# Altium schematic sheet Thermostat.schdoc: Thermostat
size 420 x 297 mm; EDA_Number: ARTIQ; Projet: Thermostat; CheckedBy: -; Author: G.Kasprowicz; CompanyName: WUT ISE; DrawnBy: G.Kasprowicz; Organization: WUT ISE; Address1: PW ISE; Address2: Nowowiejska 15/19 00-665 Warsaw; Address3: gkasprow@gmail.com; DocumentNumber: 1; SheetNumber: 1; SheetTotal: 6; ModifiedBy: -; CreateDate: -; CheckedDate: -; Title2: Top; DivGrp: WUT ISE; Designer: G.Kasprowicz; ModifiedDate: -; ProjectName: Sensor Box
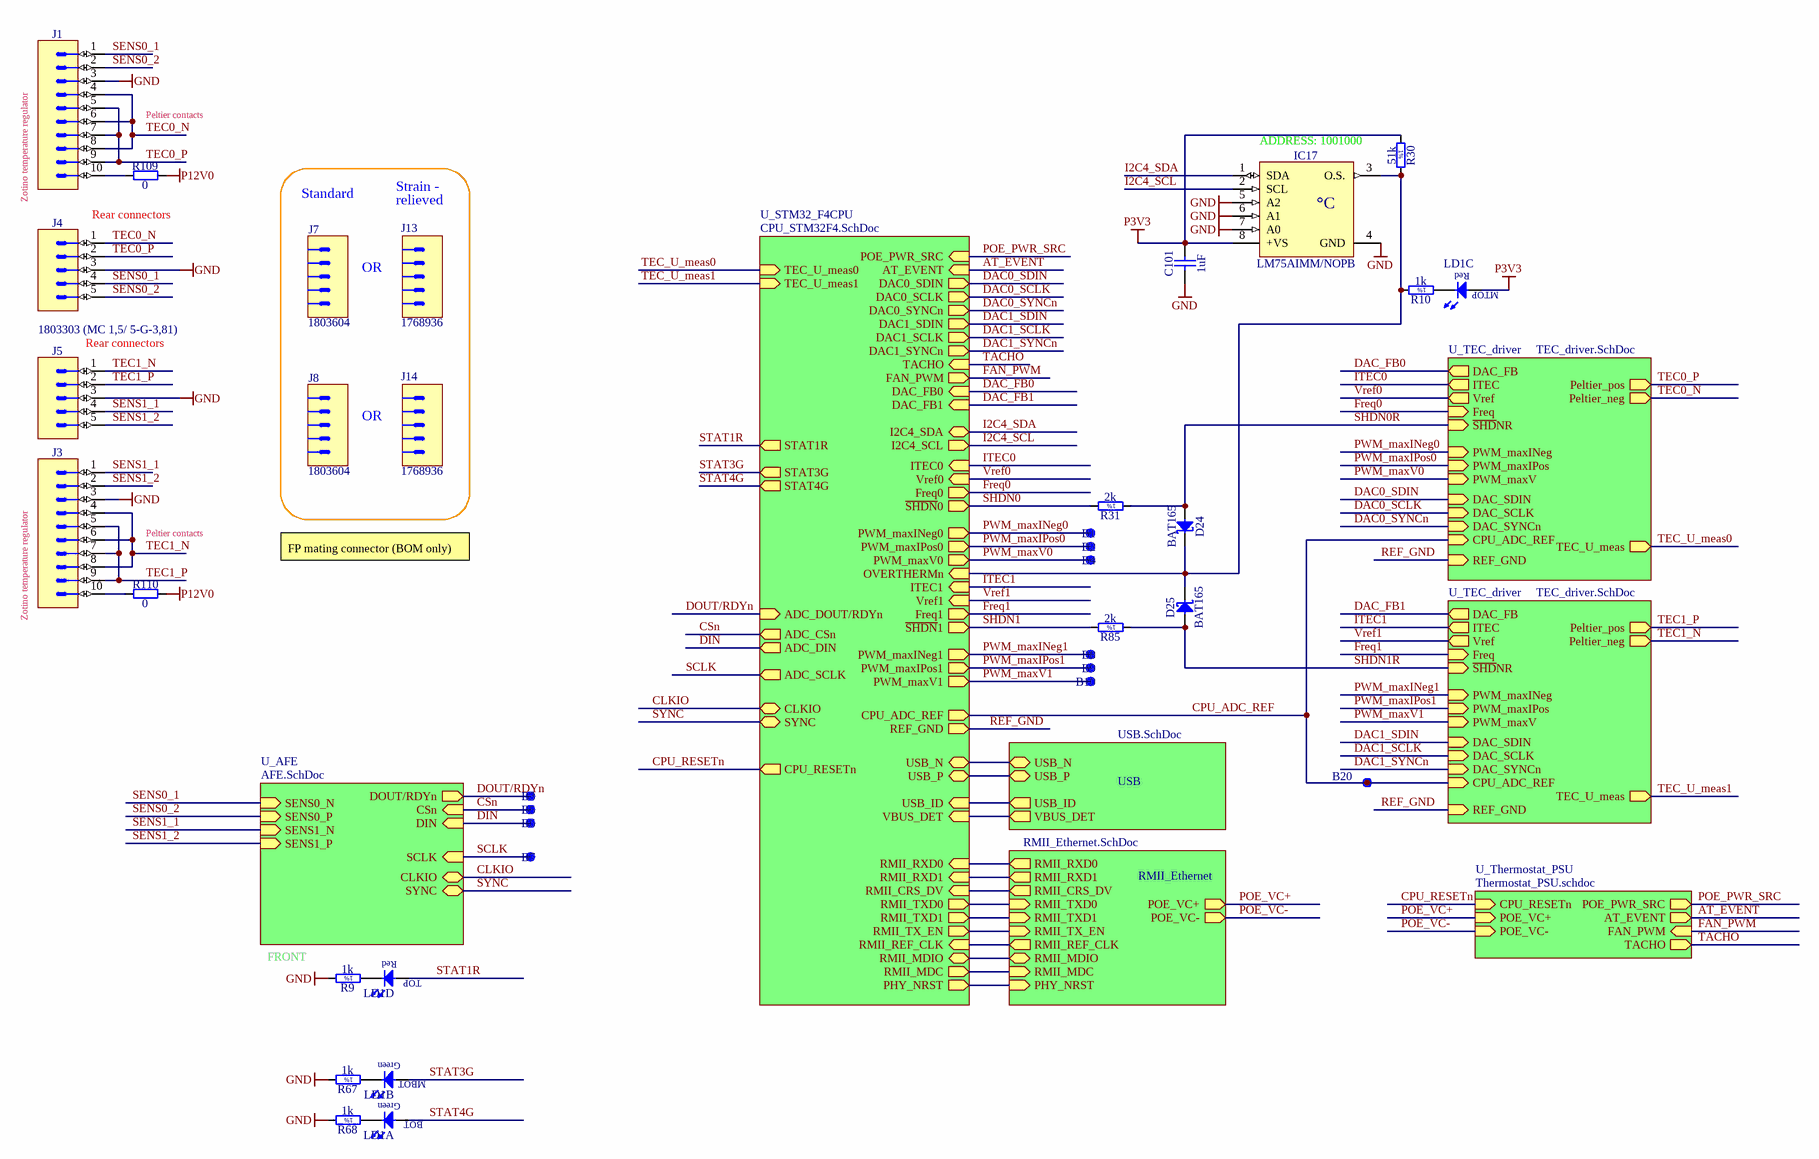
[diagram p0: Thermostat.schdoc]

## Parts
B1  SMD Pad  [C100]  (value not drawn)  (no BOM)
B2  SMD Pad  [C100]  (value not drawn)  (no BOM)
B3  SMD Pad  [C100]  (value not drawn)  (no BOM)
B4  SMD Pad  [C100]  (value not drawn)  (no BOM)
B5  SMD Pad  [C100]  (value not drawn)  (no BOM)
B6  SMD Pad  [C100]  (value not drawn)  (no BOM)
B7  SMD Pad  [C100]  (value not drawn)  (no BOM)
B8  SMD Pad  [C100]  (value not drawn)  (no BOM)
B9  SMD Pad  [C100]  (value not drawn)  (no BOM)
B10  SMD Pad  [C100]  (value not drawn)  (no BOM)
B20  SMD Pad  [C100]  (value not drawn)  (no BOM)
C101  1uF  [CAPC1608X87N]
D24  BAT165  [SOD2512X110N]
D25  BAT165  [SOD2512X110N]
IC17  LM75AIMM/NOPB  [SOP65P490X109-8N]
J1  Header 10  [3M_N2510-6002RB]  (value not drawn)
J3  Header 10  [3M_N2510-6002RB]  (value not drawn)
J4  PHOENIX_1803303  [PHOENIX_1803303]  (value not drawn)
J5  Manufacturer Part Number: 1803303 (MC 1,5/ 5-G-3,81)  [PHOENIX_1803303]  (hidden comment: PHOENIX_1803303)
J7  1803604  [PHOENIX_1803604]
J8  1803604  [PHOENIX_1803604]
J13  1768936  [PHOENIX_1768936]
J14  1768936  [PHOENIX_1768936]
LD1  Green/Green/HeRed/HeRed  [LED_BIVAR_H485CHHGGDL]  (value not drawn)  (parts A,B,C,D of 4)
R9  1k  [RESC1005X40N]
R10  1k  [RESC1005X40N]
R30  51k  [RESC1005X40N]
R31  2k  [RESC1005X40N]
R67  1k  [RESC1005X40N]
R68  1k  [RESC1005X40N]
R85  2k  [RESC1005X40N]
R109  0  [RESC1608X55N]
R110  0  [RESC1608X55N]

## Sub-sheets
RMII_Ethernet = RMII_Ethernet.SchDoc: RMII_TXD0 (in), RMII_TX_EN (in), RMII_RXD0 (out), RMII_REF_CLK (out), RMII_CRS_DV (out), RMII_MDC (in), RMII_MDIO (bidir), PHY_NRST (in), RMII_TXD1 (in), RMII_RXD1 (out), POE_VC+ (out), POE_VC- (out)
U_AFE = AFE.SchDoc: SCLK (in), DOUT/RDYn (out), SENS1_P (in), SENS1_N (in), SENS0_N (in), SENS0_P (in), CSn (in), DIN (in), CLKIO (bidir), SYNC (bidir)
U_STM32_F4CPU = CPU_STM32F4.SchDoc: STAT1R (out), OVERTHERMn (in), ITEC0 (in), Vref0 (in), Freq0 (out), ~{SHDN}0 (out), PWM_maxINeg0 (out), PWM_maxIPos0 (out), PWM_maxV0 (out), ITEC1 (in), Freq1 (out), ~{SHDN}1 (out), PWM_maxINeg1 (out), PWM_maxIPos1 (out), PWM_maxV1 (out), Vref1 (in), ADC_SCLK (out), ADC_DOUT/RDYn (in), ADC_CSn (out), ADC_DIN (out), USB_ID (in), RMII_RXD0 (in), USB_N (bidir), USB_P (bidir), RMII_TXD0 (out), RMII_RXD1 (in), RMII_MDC (out), RMII_TXD1 (out), RMII_TX_EN (out), RMII_CRS_DV (in), RMII_REF_CLK (in), RMII_MDIO (bidir), DAC0_SDIN (out), DAC0_SCLK (out), DAC0_SYNCn (out), DAC1_SDIN (out), DAC1_SCLK (out), DAC1_SYNCn (out), DAC_FB0 (in), DAC_FB1 (in), AT_EVENT (in), STAT3G (out), STAT4G (out), CLKIO (bidir), SYNC (bidir), TEC_U_meas0 (in), TEC_U_meas1 (in), CPU_RESETn (out), PHY_NRST (out), I2C4_SDA (bidir), I2C4_SCL (out), TACHO (in), CPU_ADC_REF (out), POE_PWR_SRC (in), REF_GND (out), FAN_PWM (out), VBUS_DET (in)
U_TEC_driver = TEC_driver.SchDoc: Peltier_pos (out), Peltier_neg (out), Freq (in), ~{SHD}NR (in), ITEC (out), Vref (out), PWM_maxINeg (in), PWM_maxIPos (in), PWM_maxV (in), DAC_SDIN (in), DAC_SYNCn (in), DAC_SCLK (in), DAC_FB (out), TEC_U_meas (out), REF_GND (in), CPU_ADC_REF (in)
U_TEC_driver = TEC_driver.SchDoc: Peltier_pos (out), Peltier_neg (out), Freq (in), ~{SHD}NR (in), ITEC (out), Vref (out), PWM_maxINeg (in), PWM_maxIPos (in), PWM_maxV (in), DAC_SDIN (in), DAC_SYNCn (in), DAC_SCLK (in), DAC_FB (out), TEC_U_meas (out), REF_GND (in), CPU_ADC_REF (in)
U_Thermostat_PSU = Thermostat_PSU.schdoc: CPU_RESETn (in), POE_VC+ (in), POE_VC- (in), POE_PWR_SRC (out), AT_EVENT (out), TACHO (out), FAN_PWM (in)
USB = USB.SchDoc: VBUS_DET (out), USB_N (bidir), USB_P (bidir), USB_ID (out)

## Nets
GND: C101.1 IC17.4(GND) IC17.5(A2) IC17.6(A1) IC17.7(A0) J1.3 J3.3 J4.3 J5.3 R9.2 R67.2 R68.2
P3V3: C101.2 IC17.8(+VS) LD1.6(A) R30.1
P12V0: R109.2 R110.2
~{SHDN}0: R31.2 ; sheet U_STM32_F4CPU/~{SHDN}0
~{SHDN}0R: D24.2(A) R31.1 ; sheet U_TEC_driver/~{SHD}NR
~{SHDN}1: R85.2 ; sheet U_STM32_F4CPU/~{SHDN}1
~{SHDN}1R: D25.2(A) R85.1 ; sheet U_TEC_driver/~{SHD}NR
AT_EVENT: sheet U_STM32_F4CPU/AT_EVENT, sheet U_Thermostat_PSU/AT_EVENT
CLKIO: sheet U_STM32_F4CPU/CLKIO, sheet U_AFE/CLKIO
CPU_ADC_REF: B20.1 ; sheet U_STM32_F4CPU/CPU_ADC_REF, sheet U_TEC_driver/CPU_ADC_REF, sheet U_TEC_driver/CPU_ADC_REF
CPU_RESETn: sheet U_STM32_F4CPU/CPU_RESETn, sheet U_Thermostat_PSU/CPU_RESETn
CSn: B5.1 ; sheet U_STM32_F4CPU/ADC_CSn, sheet U_AFE/CSn
DAC0_SCLK: sheet U_STM32_F4CPU/DAC0_SCLK, sheet U_TEC_driver/DAC_SCLK
DAC0_SDIN: sheet U_STM32_F4CPU/DAC0_SDIN, sheet U_TEC_driver/DAC_SDIN
DAC0_SYNCn: sheet U_STM32_F4CPU/DAC0_SYNCn, sheet U_TEC_driver/DAC_SYNCn
DAC1_SCLK: sheet U_STM32_F4CPU/DAC1_SCLK, sheet U_TEC_driver/DAC_SCLK
DAC1_SDIN: sheet U_STM32_F4CPU/DAC1_SDIN, sheet U_TEC_driver/DAC_SDIN
DAC1_SYNCn: sheet U_STM32_F4CPU/DAC1_SYNCn, sheet U_TEC_driver/DAC_SYNCn
DAC_FB0: sheet U_STM32_F4CPU/DAC_FB0, sheet U_TEC_driver/DAC_FB
DAC_FB1: sheet U_STM32_F4CPU/DAC_FB1, sheet U_TEC_driver/DAC_FB
DIN: B6.1 ; sheet U_STM32_F4CPU/ADC_DIN, sheet U_AFE/DIN
DOUT/RDYn: B3.1 ; sheet U_STM32_F4CPU/ADC_DOUT/RDYn, sheet U_AFE/DOUT/RDYn
FAN_PWM: sheet U_STM32_F4CPU/FAN_PWM, sheet U_Thermostat_PSU/FAN_PWM
Freq0: sheet U_STM32_F4CPU/Freq0, sheet U_TEC_driver/Freq
Freq1: sheet U_STM32_F4CPU/Freq1, sheet U_TEC_driver/Freq
I2C4_SCL: IC17.2(SCL) ; sheet U_STM32_F4CPU/I2C4_SCL
I2C4_SDA: IC17.1(SDA) ; sheet U_STM32_F4CPU/I2C4_SDA
ITEC0: sheet U_STM32_F4CPU/ITEC0, sheet U_TEC_driver/ITEC
ITEC1: sheet U_STM32_F4CPU/ITEC1, sheet U_TEC_driver/ITEC
POE_PWR_SRC: sheet U_STM32_F4CPU/POE_PWR_SRC, sheet U_Thermostat_PSU/POE_PWR_SRC
POE_VC+: sheet RMII_Ethernet/POE_VC+, sheet U_Thermostat_PSU/POE_VC+
POE_VC-: sheet RMII_Ethernet/POE_VC-, sheet U_Thermostat_PSU/POE_VC-
PWM_maxINeg0: B1.1 ; sheet U_STM32_F4CPU/PWM_maxINeg0, sheet U_TEC_driver/PWM_maxINeg
PWM_maxINeg1: B8.1 ; sheet U_STM32_F4CPU/PWM_maxINeg1, sheet U_TEC_driver/PWM_maxINeg
PWM_maxIPos0: B2.1 ; sheet U_STM32_F4CPU/PWM_maxIPos0, sheet U_TEC_driver/PWM_maxIPos
PWM_maxIPos1: B9.1 ; sheet U_STM32_F4CPU/PWM_maxIPos1, sheet U_TEC_driver/PWM_maxIPos
PWM_maxV0: B4.1 ; sheet U_STM32_F4CPU/PWM_maxV0, sheet U_TEC_driver/PWM_maxV
PWM_maxV1: B10.1 ; sheet U_STM32_F4CPU/PWM_maxV1, sheet U_TEC_driver/PWM_maxV
REF_GND: sheet U_STM32_F4CPU/REF_GND, sheet U_TEC_driver/REF_GND, sheet U_TEC_driver/REF_GND
SCLK: B7.1 ; sheet U_STM32_F4CPU/ADC_SCLK, sheet U_AFE/SCLK
SENS0_1: J1.1 J4.4 ; sheet U_AFE/SENS0_N
SENS0_2: J1.2 J4.5 ; sheet U_AFE/SENS0_P
SENS1_1: J3.1 J5.4 ; sheet U_AFE/SENS1_N
SENS1_2: J3.2 J5.5 ; sheet U_AFE/SENS1_P
STAT1R: LD1.8(A) ; sheet U_STM32_F4CPU/STAT1R
STAT3G: LD1.4(A) ; sheet U_STM32_F4CPU/STAT3G
STAT4G: LD1.2(A) ; sheet U_STM32_F4CPU/STAT4G
SYNC: sheet U_STM32_F4CPU/SYNC, sheet U_AFE/SYNC
TACHO: sheet U_STM32_F4CPU/TACHO, sheet U_Thermostat_PSU/TACHO
TEC0_N: J1.4 J1.6 J1.8 J4.1 ; sheet U_TEC_driver/Peltier_neg
TEC0_P: J1.5 J1.7 J1.9 J4.2 ; sheet U_TEC_driver/Peltier_pos
TEC1_N: J3.4 J3.6 J3.8 J5.1 ; sheet U_TEC_driver/Peltier_neg
TEC1_P: J3.5 J3.7 J3.9 J5.2 ; sheet U_TEC_driver/Peltier_pos
TEC_U_meas0: sheet U_STM32_F4CPU/TEC_U_meas0, sheet U_TEC_driver/TEC_U_meas
TEC_U_meas1: sheet U_STM32_F4CPU/TEC_U_meas1, sheet U_TEC_driver/TEC_U_meas
Vref0: sheet U_STM32_F4CPU/Vref0, sheet U_TEC_driver/Vref
Vref1: sheet U_STM32_F4CPU/Vref1, sheet U_TEC_driver/Vref
NetD24_1: D24.1(C) D25.1(C) IC17.3(O.S.) R10.2 R30.2 ; sheet U_STM32_F4CPU/OVERTHERMn
NetJ1_10: J1.10 R109.1
NetJ3_10: J3.10 R110.1
NetLD1_1: LD1.1(C) R68.1
NetLD1_3: LD1.3(C) R67.1
NetLD1_5: LD1.5(C) R10.1
NetLD1_7: LD1.7(C) R9.1
(unnamed): sheet U_STM32_F4CPU/USB_ID, sheet USB/USB_ID
(unnamed): sheet U_STM32_F4CPU/RMII_RXD0, sheet RMII_Ethernet/RMII_RXD0
(unnamed): sheet U_STM32_F4CPU/USB_N, sheet USB/USB_N
(unnamed): sheet U_STM32_F4CPU/USB_P, sheet USB/USB_P
(unnamed): sheet U_STM32_F4CPU/RMII_TXD0, sheet RMII_Ethernet/RMII_TXD0
(unnamed): sheet U_STM32_F4CPU/RMII_RXD1, sheet RMII_Ethernet/RMII_RXD1
(unnamed): sheet U_STM32_F4CPU/RMII_MDC, sheet RMII_Ethernet/RMII_MDC
(unnamed): sheet U_STM32_F4CPU/RMII_TXD1, sheet RMII_Ethernet/RMII_TXD1
(unnamed): sheet U_STM32_F4CPU/RMII_TX_EN, sheet RMII_Ethernet/RMII_TX_EN
(unnamed): sheet U_STM32_F4CPU/RMII_CRS_DV, sheet RMII_Ethernet/RMII_CRS_DV
(unnamed): sheet U_STM32_F4CPU/RMII_REF_CLK, sheet RMII_Ethernet/RMII_REF_CLK
(unnamed): sheet U_STM32_F4CPU/RMII_MDIO, sheet RMII_Ethernet/RMII_MDIO
(unnamed): sheet U_STM32_F4CPU/PHY_NRST, sheet RMII_Ethernet/PHY_NRST
(unnamed): sheet U_STM32_F4CPU/VBUS_DET, sheet USB/VBUS_DET

## Notes on the sheet
- Peltier contacts
- (near J13) Strain -
- ADDRESS: 1001000
- Zotino temperature regulator
- Rear connectors
- Standard
- (near J13) relieved
- (near J13) OR
- (near J5) Rear connectors
- (near J14) OR
- FP mating connector (BOM only)
- (near J3) Zotino temperature regulator
- (near R9) FRONT
- Project/Equipment
- Document
- Designer
- Drawn by
- Check.by
- Copyright WUT ISE 2020.
  This documentation describes Open Hardware and is licensed under the CERN OHL v.1.2. You may redistribute and modify this documentation under the terms of the CERN OHL v.1.2. (http://ohwr.org/CERNOHL). This documentation is distributed WITHOUT ANY EXPRESS OR IMPLIED WARRANTY, INCLUDING OF MERCHANTABILITY, SATISFACTORY QUALITY AND FITNESS FOR A PARTICULAR PURPOSE. Please see the CERN OHL v.1.2 for applicable conditions.
- Contact
- File
- Last Mod.
- Print Date
- Sheet
- Size
- A3
- of
- Rev
- (in symbol LED_BIVAR_H485CHHGGDL, part A) Green; BOT
- (in symbol LED_BIVAR_H485CHHGGDL, part B) Green; MBOT
- (in symbol LED_BIVAR_H485CHHGGDL, part C) Red; MTOP
- (in symbol LED_BIVAR_H485CHHGGDL, part D) Red; TOP
- (in symbol LM75AIMM/NOPB) °C
- (in symbol R0402_1K_1%_0.0625W_100PPM) 1%
- (in symbol R0402_2K_1%_0.0625W_100PPM) 1%
- (in symbol R0402_51K_1%_0.0625W_100PPM) 1%

## Library data of the parts
B1-B10 B20 = SMD_PAD_D1MM: Through Hole Pad; Part Description: 1mm Diameter SMD Pad; Mounted: No; Part Number: SMD_PAD_D1MM; Component Type: Standard (No BOM); Pin Count: 1; Family: SMD Pad; Socket: No; SMD: No; Sense: No; Status: None; ComponentHeight: 0mm; HelpURL: Undefined; Author: CERN DEM JLC; CreateDate: 10.10.2017; LatestRevisionDate: 10.10.2017; PackageDescription: 1mm Diameter SMD Pad
C101 = CC0603_1UF_25V_10%_X7R: Non-polarised capacitor; Part Description: SMD Multilayer Chip Ceramic Capacitor; Manufacturer: GENERIC; Manufacturer1 Part Number: GRM188R71E105KA12D; Voltage: 25V; TC: X7R; Tolerance: ±10%; Part Number: CC0603_1UF_25V_10%_X7R; Component Kind: Standard; Component Type: Standard; Pin Count: 2; Value: 1uF; Status: None; Manufacturer Part Number: CC0603_1UF_25V_10%_X7R; Case: 0603; Mounted: Yes; Socket: No; SMD: Yes; Sense: No; Manufacturer1 Example: MURATA; Manufacturer1 ComponentHeight: 0.9mm; HelpURL: \\cern.ch\dfs\Applications\Altium\Datasheets\CC0603_X7R_MURATA.pdf; Author: CERN DEM JLC; CreateDate: 18/01/2011; LatestRevisionDate: 18/01/2011
D24 D25 = BAT165: Schottky Diode; Part Description: Medium Power AF Schottky Diode; Manufacturer: INFINEON; Voltage: 40V; Power: 750mA; PressFit: No; Bonding: No; Part Number: BAT165; Component Kind: Standard; Component Type: Standard; Device: BAT165; PackageDescription: Small Outline Diode Flat Lead (SOD-323), 1.70mm W X 1.25mm L X 1.10mm H body,  IPC Medium Density; Manufacturer Part Number: BAT165; Pin Count: 2; Case: SOD323; Mounted: Yes; Socket: No; SMD: Yes; Sense: No; ComponentHeight: 1.1mm; HelpURL: \\cern.ch\dfs\Applications\Altium\Datasheets\BAT165.pdf; Author: CERN DEM JLC; CreateDate: 12.11.2014; LatestRevisionDate: 12.11.2014
IC17 = LM75AIMM/NOPB: Digital Temperature Sensor and Thermal Watchdog with Two-Wire Interface; Part Description: -25° to +100°C ±2°C Digital Temperature Sensor and Thermal Watchdog with Two-Wire Interface; Manufacturer: TEXAS INSTRUMENTS; PressFit: No; Bonding: No; Part Number: LM75AIMM/NOPB; Component Kind: Standard; Component Type: Standard; Device: LM75AIMM/NOPB; PackageDescription: SOP, 0.65mm pitch; 8 pin,3.00mm W X 3.00mm L X 1.09mm H bodyI, PC Medium Density; Manufacturer Part Number: LM75AIMM/NOPB; Pin Count: 8; Case: SSOP8; Mounted: Yes; Socket: No; SMD: Yes; Sense: No; ComponentHeight: 1.09mm; HelpURL: \\cern.ch\dfs\Applications\Altium\Datasheets\LM75AIMM-NOPB.pdf; Author: CERN DEM JLC; CreateDate: 15.10.2012; LatestRevisionDate: 15.10.2012
J1 J3 = 3M_N2510-6002RB: Connector 10 Male; Part Description: 10 Contacts - Straight .100'' x .100'' Low Profile Four-Wall Header, 2500 Series; Manufacturer: 3M; PressFit: No; Part Number: 3M_N2510-6002RB; Component Kind: Standard; Component Type: Standard; Pin Count: 10; Family: Header 10; Mounted: Yes; Socket: No; SMD: No; Sense: No; Status: None; Manufacturer Part Number: N2510-6002RB; ComponentHeight: 10.03mm; HelpURL: \\cern.ch\dfs\Applications\Altium\Datasheets\3M_N2510-6002RB.pdf; Author: CERN DEM JLC; CreateDate: 11.02.2009; LatestRevisionDate: 11.08.2009
J4 = PHOENIX_1803303: Connector 5 Male; Part Description: 8A 160 V, Pitch: 3.81mm, 5 Positions  Right Angled Header; Manufacturer: PHOENIX CONTACT; Manufacturer Part Number: 1803303 (MC 1,5/ 5-G-3,81); PressFit: No; Part Number: PHOENIX_1803303; Component Kind: Standard; Component Type: Standard; Pin Count: 5; Mounted: Yes; Socket: No; SMD: No; Sense: No; Status: None; ComponentHeight: 7.25mm; HelpURL: \\cern.ch\dfs\Applications\Altium\Datasheets\PHOENIX_1803303.pdf; Author: CERN DEM JLC; CreateDate: 11/06/2013; LatestRevisionDate: 11/06/2013
J5 = PHOENIX_1803303: Connector 5 Male; Part Description: 8A 160 V, Pitch: 3.81mm, 5 Positions  Right Angled Header; Manufacturer: PHOENIX CONTACT; PressFit: No; Part Number: PHOENIX_1803303; Component Kind: Standard; Component Type: Standard; Pin Count: 5; Mounted: Yes; Socket: No; SMD: No; Sense: No; Status: None; ComponentHeight: 7.25mm; HelpURL: \\cern.ch\dfs\Applications\Altium\Datasheets\PHOENIX_1803303.pdf; Author: CERN DEM JLC; CreateDate: 11/06/2013; LatestRevisionDate: 11/06/2013
J7 J8 = PHOENIX_1803604: Phoenix Contact 3.81 pitch terminal plug, 5 ways; Mates with: PHOENIX_1803303; Manufacturer: Phoenix Contact; Manufacturer Part Number: 1803604
J13 J14 = PHOENIX_1768936: PHOENIX TB connector MC 1,5/ 5-STZ2-3,81 -; Manufacturer: Phoenix Contact; Mates with: PHOENIX_1803303; Manufacturer Part Number: 1768936
LD1 = LED_BIVAR_H485CHHGGDL: LED x4 G-1C2A-BOT_G-3C4A_H-5C6A_H-7C8A-TOP; Part Description: Quad-Level 2mm (Green+Green+HeRed+HeRed) LED, PCB Edge Mounting; Manufacturer: BIVAR; PressFit: No; Bonding: No; Part Number: LED_BIVAR_H485CHHGGDL; Component Kind: Standard; Component Type: Standard; Color: Green/Green/HeRed/HeRed; PackageDescription: Quad-Level 2mm (Green+Green+HeRed+HeRed) LED, PCB Edge Mounting  BIVAR H485C Serie; Status: Not Recommended; Manufacturer Part Number: H485CHHGGDL; Pin Count: 8; Mounted: Yes; Socket: No; SMD: No; Sense: No; ComponentHeight: 11.3mm; HelpURL: \\cern.ch\dfs\Applications\Altium\Datasheets\LED_BIVAR_H485C.pdf; Author: CERN DEM BC; CreateDate: 12.11.2015; LatestRevisionDate: 12.11.2015
R9 R10 R67 R68 = R0402_1K_1%_0.0625W_100PPM: Resistor - 1%; Part Description: General Purpose Thick Film Chip Resistor; Manufacturer: GENERIC; Manufacturer1 Part Number: 232270671002L; TC: ±100ppm/°C; PressFit: No; Part Number: R0402_1K_1%_0.0625W_100PPM; Component Kind: Standard; Component Type: Standard; Pin Count: 2; Value: 1k; Status: Not Recommended; Power: 0.0625W; Tolerance: ±1%; Manufacturer Part Number: R0402_1K_1%_0.0625W_100PPM; Case: 0402; Mounted: Yes; Sense: No; Socket: No; SMD: Yes; Manufacturer1 Example: YAGEO PHYCOMP; Manufacturer1 ComponentHeight: 0.4mm; HelpURL: \\cern.ch\dfs\Applications\Altium\Datasheets\R0402_Phycomp_RC0402.pdf; Author: CERN DEM JLC; CreateDate: 03.12.2007; LatestRevisionDate: 17.10.2012
R30 = R0402_51K_1%_0.0625W_100PPM: Resistor - 1%; Part Description: General Purpose Thick Film Chip Resistor; Manufacturer: GENERIC; Manufacturer1 Part Number: 232270674703L; TC: ±100ppm/°C; PressFit: No; Part Number: R0402_51K_1%_0.0625W_100PPM; Component Kind: Standard; Component Type: Standard; Pin Count: 2; Value: 51k; Status: Not Recommended; Power: 0.0625W; Tolerance: ±1%; Manufacturer Part Number: R0402_51K_1%_0.0625W_100PPM; Case: 0402; Mounted: Yes; Sense: No; Socket: No; SMD: Yes; Manufacturer1 Example: YAGEO PHYCOMP; Manufacturer1 ComponentHeight: 0.4mm; HelpURL: \\cern.ch\dfs\Applications\Altium\Datasheets\R0402_Phycomp_RC0402.pdf; Author: CERN DEM JLC; CreateDate: 03.12.2007; LatestRevisionDate: 17.10.2012
R31 R85 = R0402_2K_1%_0.0625W_100PPM: Resistor - 1%; Part Description: General Purpose Thick Film Chip Resistor; Manufacturer: GENERIC; Manufacturer1 Part Number: 232270672002L; TC: ±100ppm/°C; PressFit: No; Part Number: R0402_2K_1%_0.0625W_100PPM; Component Kind: Standard; Component Type: Standard; Pin Count: 2; Value: 2k; Status: Not Recommended; Power: 0.0625W; Tolerance: ±1%; Manufacturer Part Number: R0402_2K_1%_0.0625W_100PPM; Case: 0402; Mounted: Yes; Sense: No; Socket: No; SMD: Yes; Manufacturer1 Example: YAGEO PHYCOMP; Manufacturer1 ComponentHeight: 0.4mm; HelpURL: \\cern.ch\dfs\Applications\Altium\Datasheets\R0402_Phycomp_RC0402.pdf; Author: CERN DEM JLC; CreateDate: 03.12.2007; LatestRevisionDate: 17.10.2012
R109 R110 = R0603_0R_JUMPER: Resistor; Part Description: 1A (0.05R Max DC Resistance) Zero Ohm Jumper; Manufacturer: GENERIC; Manufacturer1 Part Number: NRC06Z0; PressFit: No; Part Number: R0603_0R_JUMPER; Component Kind: Standard; Component Type: Standard; Pin Count: 2; Value: 0; Status: Preferred; Manufacturer Part Number: R0603_0R_JUMPER; Case: 0603; Mounted: Yes; Sense: No; Socket: No; SMD: Yes; Manufacturer1 Example: NIC COMPONENT; Manufacturer1 ComponentHeight: 0.55mm; HelpURL: \\cern.ch\dfs\Applications\Altium\Datasheets\R0603_NIC_NRC.pdf; Author: CERN DEM JLC; CreateDate: 03.12.2007; LatestRevisionDate: 13.03.2008